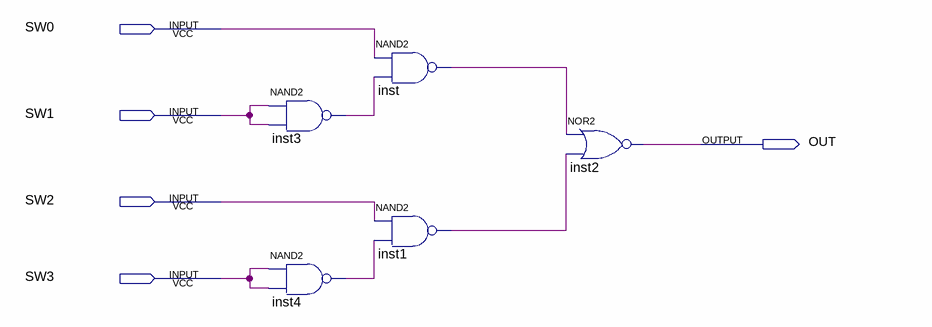
[diagram p0: schematic sheet]
// Quartus schematic Lab2_Part1.bdf as structural Verilog: 5 symbols, 5 pins
module Lab2_Part1 (
  input  SW0,
  input  SW1,
  input  SW2,
  input  SW3,
  output OUT
);

  wire inst1_out, inst3_out, inst4_out, inst_out;

  nand inst3 (inst3_out, SW1, SW1);
  nand inst4 (inst4_out, SW3, SW3);
  nand inst (inst_out, SW0, inst3_out);
  nand inst1 (inst1_out, SW2, inst4_out);
  nor inst2 (OUT, inst_out, inst1_out);
endmodule
